# EAGLE design booster-pump-interlock (EAGLE 9.0.1)
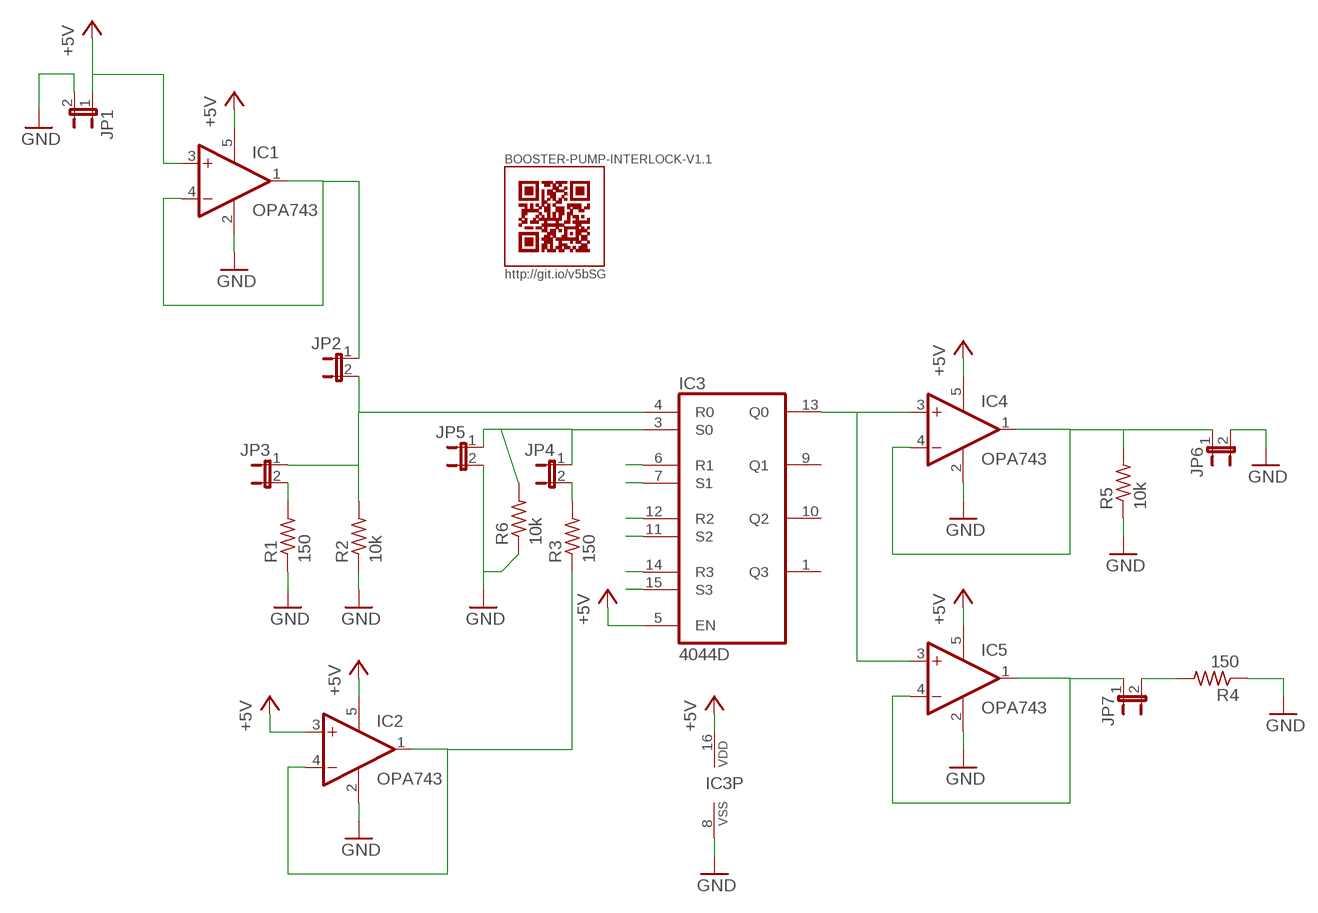
[diagram p0: schematic, sheet 1]

## Parts
BOOSTER-PUMP-INTERLOCK-V1.1  QR-HTTP://GIT.IO/V5BSG-WIRE  [QR-HTTP://GIT.IO/V5BSG-WIRE]
IC1  OPA743  [SOT23-5]
IC2  OPA743  [SOT23-5]
IC3  4044D  [SO16]
IC4  OPA743  [SOT23-5]
IC5  OPA743  [SOT23-5]
JP1  JP1E  [JP1]
JP2  JP1E  [JP1]
JP3  JP1E  [JP1]
JP4  JP1E  [JP1]
JP5  JP1E  [JP1]
JP6  JP1E  [JP1]
JP7  JP1E  [JP1]
R1  150  R-US_R0805  [R0805]
R2  10k  R-US_R0805  [R0805]
R3  150  R-US_R0805  [R0805]
R4  150  R-US_R0805  [R0805]
R5  10k  R-US_R0805  [R0805]
R6  10k  R-US_M1206  [M1206]

## Nets
+5V: IC1.3(+IN) IC1.5(V+) IC2.3(+IN) IC2.5(V+) IC3.5(EN) IC3.16(VDD) IC4.5(V+) IC5.5(V+) JP1.1
GND: IC1.2(V-) IC2.2(V-) IC3.6(R1) IC3.7(S1) IC3.8(VSS) IC3.11(S2) IC3.12(R2) IC3.14(R3) IC3.15(S3) IC4.2(V-) IC5.2(V-) JP1.2 JP5.2 JP6.2 R1.1 R2.1 R4.1 R5.1 R6.1
N$2: JP3.2 R1.2
N$4: JP4.2 R3.2
N$8: IC4.1(OUT) IC4.4(-IN) JP6.1 R5.2
N$9: JP7.2 R4.2
N$10: IC5.1(OUT) IC5.4(-IN) JP7.1
PWR1: IC1.1(OUT) IC1.4(-IN) JP2.1
PWR2: IC2.1(OUT) IC2.4(-IN) R3.1
Q0: IC3.13(Q0) IC4.3(+IN) IC5.3(+IN)
R0: IC3.4(R0) JP2.2 JP3.1 R2.2
S0: IC3.3(S0) JP4.1 JP5.1 R6.2
Unconnected: IC3.1(Q3) IC3.9(Q1) IC3.10(Q2)

## Library data of the parts
BOOSTER-PUMP-INTERLOCK-V1.1 = QR-git.io-v5bSG:QR-HTTP://GIT.IO/V5BSG: QR Code pointing to http://git.io/v5bSG -WIRE if a wire-based rendering for silks screens lighter than the solder mask. -LIGHT-SILK is a rectangle-based rendering for silks lighter than the solder mask. -DARK-SILK is a rectangle-based rendering for silks darker than the solder mask.; QR_DEST: http://git.io/v5bSG; QR_DEST_SHORT: git.io/v5bSG
IC1 IC2 IC4 IC5 = linear:OPA743: 12V, 7MHz, CMOS, Rail-to-Rail I/O OP AMP Source: http://focus.ti.com/lit/ds/sbos201/sbos201.pdf; PARTNO: OPA743NA/3KCT-ND
IC3 = 40xx:4044: Quad 3-state NAND R/S LATCH
JP1-JP7 = jumper:JP1E: JUMPER
R1-R6 = rcl:R-US_: RESISTOR, American symbol

## Board
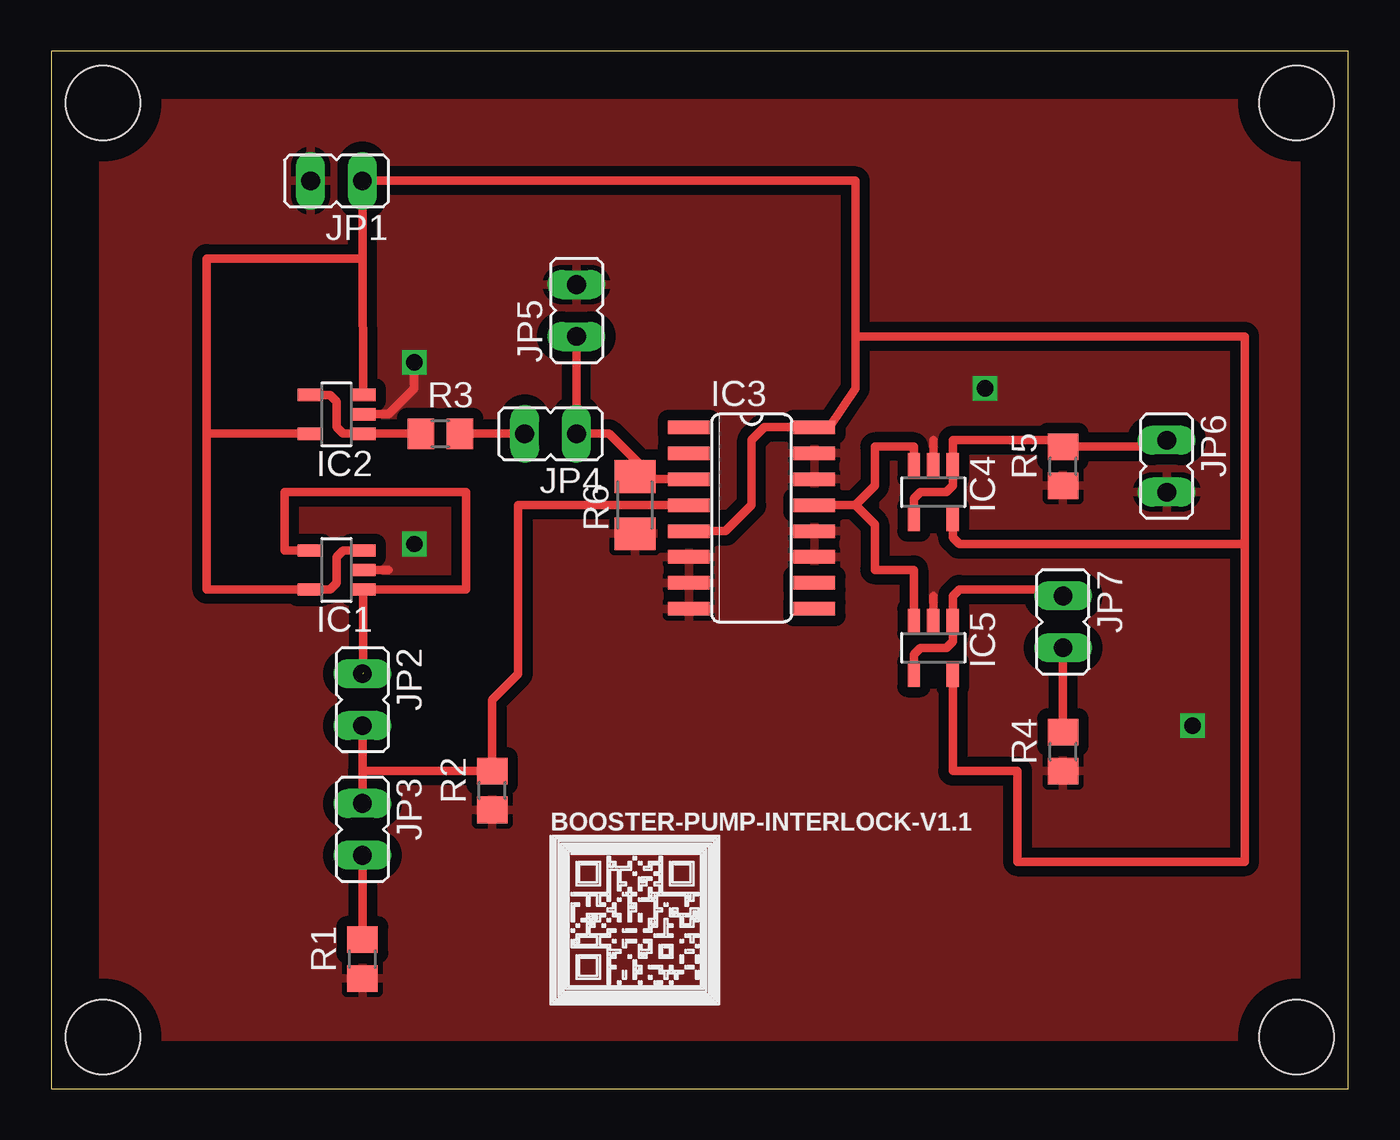
[diagram p1: board, top side]
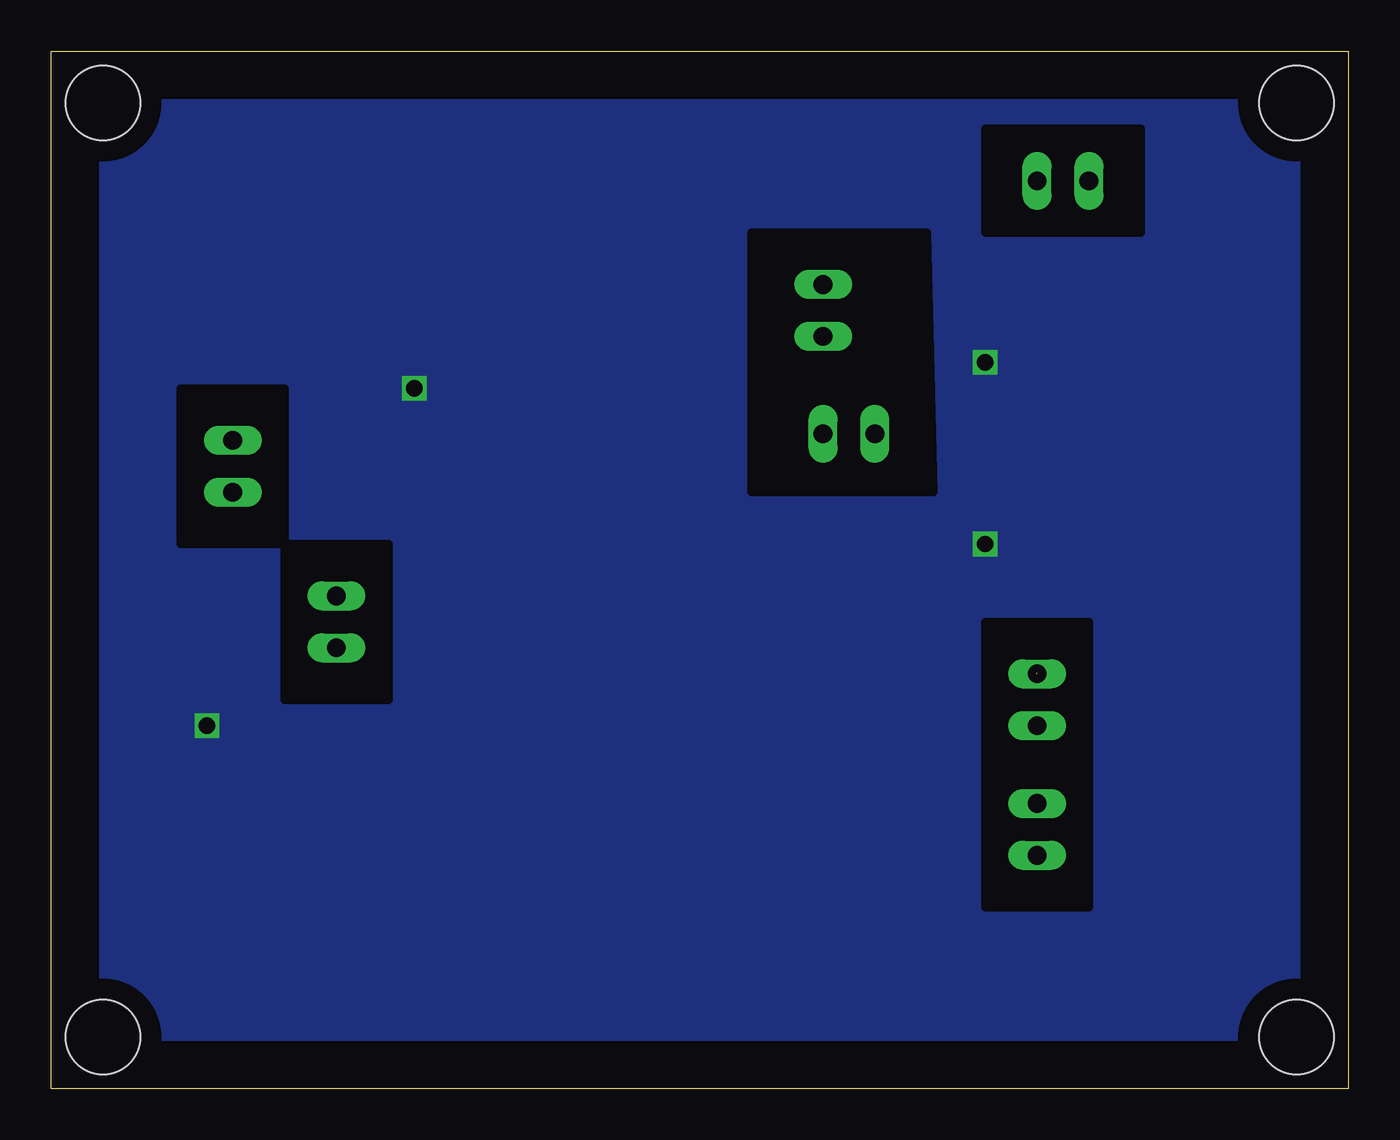
[diagram p2: board, bottom side, seen from below]

Size 63.5 x 50.8 mm. Coordinates in mm from the lower left corner, seen from the top.
Outline: 0,0 63.5,0 63.5,50.8 0,50.8 0,0
Copper layers (1*16): Top 0.035mm / dielectric 1.5mm / Bottom 0.035mm
Design rules "default": minimum track width 10mil, minimum drill 24mil, track to track 8mil, track to pad 8mil, pad to pad 8mil, via to via 8mil, smd to smd 8mil, copper to edge 40mil, drill to drill 8mil, minimum pad ring 10mil, minimum via ring 8mil, stop-mask expansion 4mil, vias tented up to drill 0mil, thermal gap 10mil
Holes 3.66 mm at 2.54,2.54 2.54,48.26 60.96,48.26 60.96,2.54

### Footprints (pad centres in the part's own frame; a part is rotated, then mirrored left to right if it is on the bottom)
SOT23-5 = smd 0.6 x 1.2: 1 -0.95,-1.306; 2 0,-1.306; 3 0.95,-1.306; 4 0.95,1.306; 5 -0.95,1.306
SO16 = smd 0.66 x 2.032: 1 -4.445,-3.073; 2 -3.175,-3.073; 3 -1.905,-3.073; 4 -0.635,-3.073; 5 0.635,-3.073; 6 1.905,-3.073; 7 3.175,-3.073; 8 4.445,-3.073; 9 4.445,3.073; 10 3.175,3.073; 11 1.905,3.073; 12 0.635,3.073; 13 -0.635,3.073; 14 -1.905,3.073; 15 -3.175,3.073; 16 -4.445,3.073
JP1 = drill 0.914 long: 1 0,-1.27; 2 0,1.27
R0805 = smd 1.3 x 1.5: 1 -0.95,0; 2 0.95,0
M1206 = smd 1.6 x 2: 1 -1.4,0; 2 1.4,0

### Placement (x,y rotation side)
BOOSTER-PUMP-INTERLOCK-V1.1  28.57,8.26 0 top
IC1  13.97,25.4 90 top
IC2  13.97,33.02 90 top
IC3  34.29,27.94 270 top
IC4  43.18,29.21 180 top
IC5  43.18,21.59 180 top
JP1  13.97,44.45 90 top
JP2  15.24,19.05 180 top
JP3  15.24,12.7 180 top
JP4  24.45,32.07 90 top
JP5  25.72,38.1 0 top
JP6  54.61,30.48 180 top
JP7  49.53,22.86 180 top
R1  15.24,6.35 90 top
R2  21.59,14.61 90 top
R3  19.05,32.07 0 top
R4  49.53,16.51 90 top
R5  49.53,30.48 90 top
R6  28.57,28.57 90 top

### Tracks (layer width: path | path; a pad name or v marks a point on that pad's centre or on a via)
+5V
  Top 0.406: IC3.5 33.02,27.3 34.29,28.57 34.29,31.75 34.92,32.38 IC3.16 38.1,32.38 39.37,34.29 39.37,36.83 | IC4.5 44.13,28.26 44.13,26.99 44.45,26.67 58.42,26.67 | 7.62,32.07 7.62,24.45 IC1.5 13.65,24.45 13.97,24.77 13.97,26.04 14.29,26.35 IC1.3 | 7.62,32.07 7.62,40.64 15.24,40.64 | 15.24,40.64 JP1.1 39.37,44.45 39.37,36.83 | IC2.3 15.24,40.64 | IC2.5 7.62,32.07 | 58.42,26.67 58.42,11.11 47.31,11.11 47.31,15.56 44.13,15.56 IC5.5 | 58.42,26.67 58.42,36.83 39.37,36.83
GND  (via drill 0.8)
  Top 0.406: IC2.2 16.51,33.02 17.78,34.29 v17.78,35.56 | IC4.2 43.18,31.75 | IC5.2 43.18,24.13 | IC1.2 16.51,25.4
  other vias: 17.78,26.67 45.72,34.29 55.88,17.78
  pour Top (isolate 0.508): 2.54,48.26 2.54,2.54 60.96,2.54 60.96,48.26
  pour Bottom: 2.54,2.54 2.54,48.26 60.96,48.26 60.96,2.54
N$2
  Top 0.406: JP3.2 R1.2
N$3
  cutout Bottom: 10.16,46.99 17.78,46.99 17.78,41.91 10.16,41.91
N$4
  Top 0.406: R3.2 JP4.2
N$5
  cutout Bottom: 20.64,41.91 29.21,41.91 29.21,29.21 20.32,29.21
N$7
  cutout Bottom: 12.7,22.86 17.78,22.86 17.78,8.89 12.7,8.89
N$8
  Top 0.406: IC4.4 42.23,28.89 42.55,29.21 43.81,29.21 44.13,29.52 IC4.1 44.13,31.75 49.21,31.75 R5.2 54.29,31.43 JP6.1
N$9
  Top 0.406: JP7.2 R4.2
N$10
  Top 0.406: IC5.4 42.23,21.27 42.55,21.59 43.81,21.59 44.13,21.91 IC5.1 44.13,24.13 44.45,24.45 49.21,24.45 JP7.1
N$11
  cutout Bottom: 46.99,26.67 52.07,26.67 52.07,19.05 46.99,19.05
N$12
  cutout Bottom: 52.07,34.29 57.15,34.29 57.15,26.67 52.07,26.67
PWR1  (1 unrouted)
  Top 0.406: 15.28,20.36 IC1.1 20.32,24.45 20.32,29.21 11.43,29.21 11.43,26.35 IC1.4
PWR2
  Top 0.406: IC2.4 13.65,33.97 13.97,33.66 13.97,32.38 14.29,32.07 IC2.1 R3.1
Q0
  Top 0.406: IC4.3 42.23,31.43 40.32,31.43 40.32,29.53 39.37,28.57 | 39.37,28.57 IC3.13 | 39.37,28.57 40.32,27.62 40.32,25.4 42.23,25.4 IC5.3
R0
  Top 0.406: JP2.2 15.24,15.55 | 15.24,15.55 JP3.1 | 15.24,15.55 R2.2 21.59,19.05 22.86,20.32 22.86,28.57 IC3.4
S0
  Top 0.406: 29.21,30.16 27.3,32.07 JP4.1 JP5.1 | 29.21,30.16 29.53,29.84 IC3.3 | R6.2 28.76,30.16 29.21,30.16